# EAGLE schematic LinPsu (EAGLE 7.6.0)
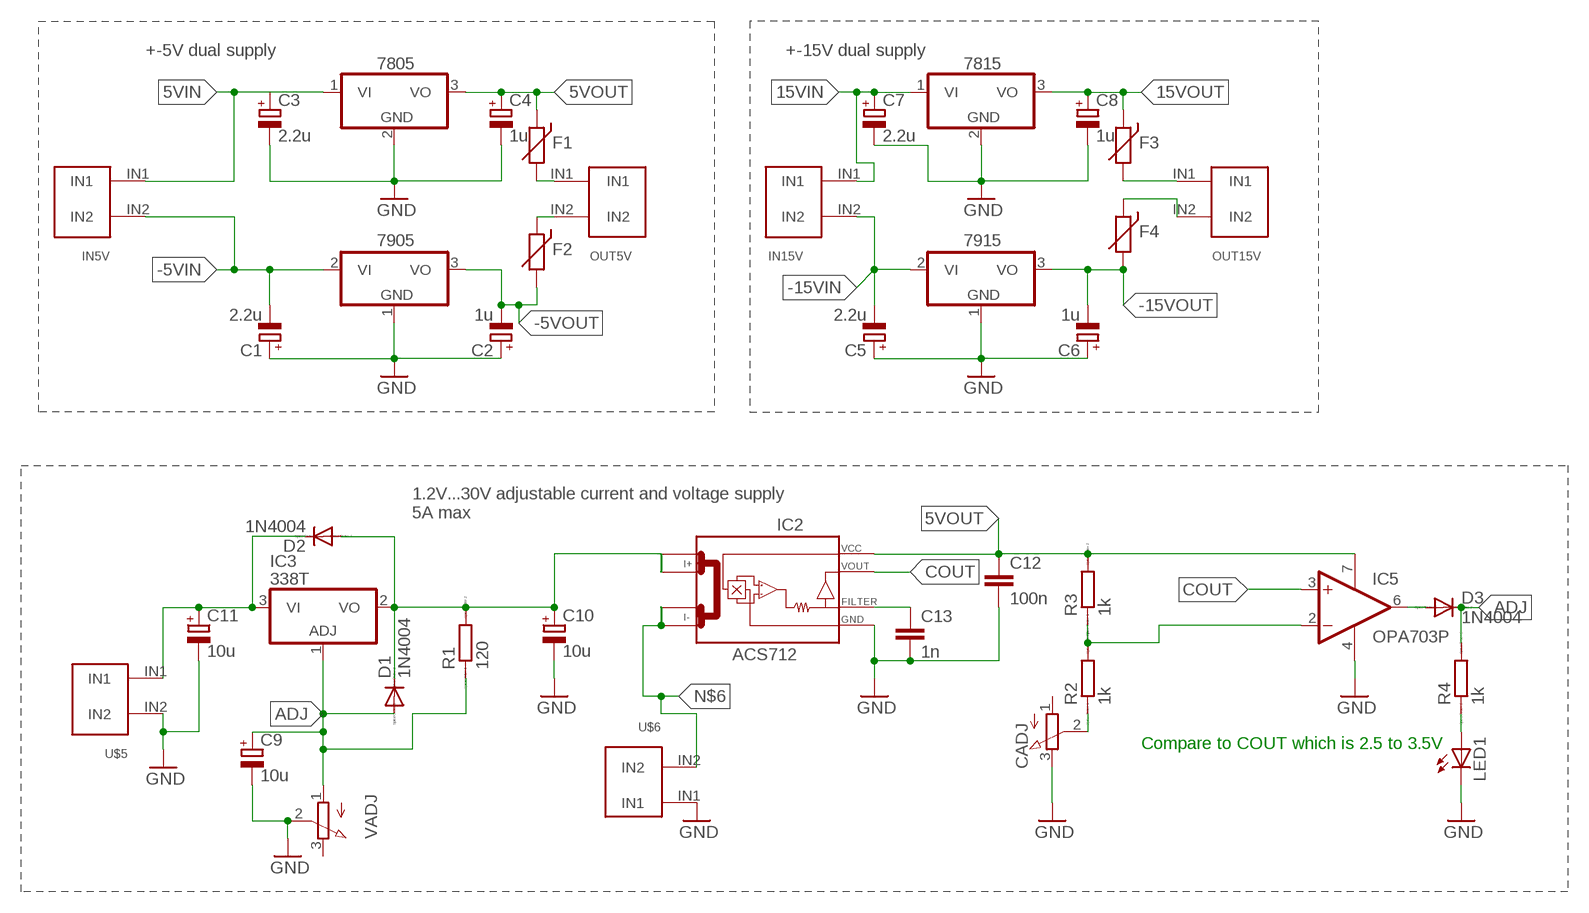
[diagram p0: schematic, sheet 1]

## Parts
7805  7805  7815T  [TO220H]
7815  7815T  [TO220H]
7905  7905T  [TO220H]
7915  7915T  [TO220H]
C1  2.2u  CPOL-EUE5-5  [E5-5]
C2  1u  CPOL-EUE5-4  [E5-4]
C3  2.2u  CPOL-EUE5-5  [E5-5]
C4  1u  CPOL-EUE5-4  [E5-4]
C5  2.2u  CPOL-EUE5-5  [E5-5]
C6  1u  CPOL-EUE5-4  [E5-4]
C7  2.2u  CPOL-EUE5-5  [E5-5]
C8  1u  CPOL-EUE5-4  [E5-4]
C9  10u  CPOL-EUE5-5  [E5-5]
C10  10u  CPOL-EUE5-5  [E5-5]
C11  10u  CPOL-EUE5-5  [E5-5]
C12  100n  C2.5/4  [C2.5-4]
C13  1n  C2.5/4  [C2.5-4]
CADJ  3RP/1610N  [3RP/1610N]
D1  1N4004  [DO41-10]
D2  1N4004  [DO41-10]
D3  1N4004  [DO41-10]
F1  THERMISTOR-5  [R-5]
F2  THERMISTOR-5  [R-5]
F3  THERMISTOR-5  [R-5]
F4  THERMISTOR-5  [R-5]
IC2  ACS712  [SO08]
IC3  338T  317T  [TO220H]
IC5  OPA703P  OPA743P  [DIL08]
IN5V  1X2_5MM  [1X2_5MM]
IN15V  1X2_5MM  [1X2_5MM]
LED1  LED3MM  [LED3MM]
OUT5V  1X2_5MM  [1X2_5MM]
OUT15V  1X2_5MM  [1X2_5MM]
R1  120  R0207/10  [0207/10]
R2  1k  R0207/10  [0207/10]
R3  1k  R0207/10  [0207/10]
R4  1k  R0207/10  [0207/10]
U$5  1X2_5MM  [1X2_5MM]
U$6  1X2_5MM  [1X2_5MM]
VADJ  3RP/1610N  [3RP/1610N]

## Nets
5VIN: 7805.1(VI) C3.+ IN5V.IN1
5VOUT: 7805.3(VO) C4.+ C12.1 F1.1 IC2.8(VCC) IC5.7(V+) R3.2
15VIN: 7815.1(VI) C7.+ IN15V.IN1
15VOUT: 7815.3(VO) C8.+ F3.1
-5VIN: 7905.2(VI) C1.- IN5V.IN2
-5VOUT: 7905.3(VO) C2.- F2.2
-15VIN: 7915.2(VI) C5.- IN15V.IN2
-15VOUT: 7915.3(VO) C6.- F4.2
ADJ: C9.+ D1.A D3.C IC3.1(ADJ) R1.1 R4.2 VADJ.1(A)
COUT: IC2.7(VOUT) IC5.3(+IN)
GND: 7805.2(GND) 7815.2(GND) 7905.1(GND) 7915.1(GND) C1.+ C2.+ C3.- C4.- C5.+ C6.+ C7.- C8.- C9.- C10.- C11.- C12.2 C13.2 CADJ.3(E) IC2.5(GND) IC5.4(V-) LED1.K(C) U$5.IN2 U$6.IN1 VADJ.2(S)
N$1: C11.+ D2.C IC3.3(VI) U$5.IN1
N$2: F1.2 OUT5V.IN1
N$3: LED1.A R4.1
N$4: D3.A IC5.6(OUT)
N$5: C13.1 IC2.6(FILTER)
N$6: IC2.3(I-_0) IC2.4(I-_1) U$6.IN2
N$7: IC5.2(-IN) R2.2 R3.1
N$8: F2.1 OUT5V.IN2
N$9: CADJ.2(S) R2.1
N$10: F3.2 OUT15V.IN1
OUT15V: F4.1 OUT15V.IN2
VOUTADJ: C10.+ D1.C D2.A IC2.1(I+_0) IC3.2(VO) R1.2
Unconnected: CADJ.1(A) IC2.2(I+_1) VADJ.3(E)

## Notes on the sheet
- +-5V dual supply | +-15V dual supply
- 1.2V...30V adjustable current and voltage supply
  5A max
- Compare to COUT which is 2.5 to 3.5V

## Library data of the parts
7805 7815 = linear:78*: Positive VOLTAGE REGULATOR Source: http://cache.national.com/ds/LM/LM78L05.pdf http://www.fairchildsemi.com/ds/LM/LM7805.pdf
7905 7915 = linear:79*: Negative VOLTAGE REGULATOR
C1-C11 = rcl:CPOL-EU: POLARIZED CAPACITOR, European symbol
C12 C13 = capacitor-wima:C: CAPACITOR naming: grid - package width
CADJ VADJ = dorupot:3RP/1610N: 16mm Potentiometer one level Source: http://www.alphapotentiometers.net/html/16mm_pot_2.html
D1-D3 = diode:1N4004: DIODE general purpose rectifier, 1 A
F1-F4 = varistor:THERMISTOR: THERMISTOR
IC2 = ACS712:ACS712
IC3 = linear:*317: Positive VOLTAGE REGULATOR
IC5 = linear:OPA743: 12V, 7MHz, CMOS, Rail-to-Rail I/O OP AMP Source: http://focus.ti.com/lit/ds/sbos201/sbos201.pdf
IN5V IN15V OUT5V OUT15V U$5 U$6 = doru_terminal_block:1X2_5MM
LED1 = led:LED: LED OSRAM: - CHIPLED LG R971, LG N971, LY N971, LG Q971, LY Q971, LO R971, LY R971 LH N974, LH R974 LS Q976, LO Q976, LY Q976 LO Q996 - Hyper CHIPLED LW Q18S LB Q993, LB Q99A, LB R99A - SideLED LS A670, LO A670, LY A670, LG A670, LP A670 LB A673, LV A673, LT A673, LW A673 LH A674 LY A675 LS A676, LA A676, LO A676, LY A676, LW A676 LS A679, LY A679, LG A679 - Hyper Micro SIDELED® LS Y876, LA Y876, LO Y876, LY Y876 LT Y87S - SmartLED LW L88C, LW L88S LB L89C, LB L89S, LG L890 LS L89K, LO L89K, LY L89K LS L896, LA L896, LO L896, LY L896 - TOPLED LS T670, LO T670, LY T670, LG T670, LP T670 LSG T670, LSP T670, LSY T670, LOP T670, LYG T670 LG T671, LOG T671, LSG T671 LB T673, LV T673, LT T673, LW T673 LH T674 LS T676, LA T676, LO T676, LY T676, LB T676, LH T676, LSB T676, LW T676 LB T67C, LV T67C, LT T67C, LS T67K, LO T67K, LY T67K, LW E67C LS E67B, LA E67B, LO E67B, LY E67B, LB E67C, LV E67C, LT E67C LW T67C LS T679, LY T679, LG T679 LS T770, LO T770, LY T770, LG T770, LP T770 LB T773, LV T773, LT T773, LW T773 LH T774 LS E675, LA E675, LY E675, LS T675 LS T776, LA T776, LO T776, LY T776, LB T776 LHGB T686 LT T68C, LB T68C - Hyper Mini TOPLED® LB M676 - Mini TOPLED Santana® LG M470 LS M47K, LO M47K, LY M47K Source: http://www.osram.convergy.de LUXEON: - LUMILED® LXK2-PW12-R00, LXK2-PW12-S00, LXK2-PW14-U00, LXK2-PW14-V00 LXK2-PM12-R00, LXK2-PM12-S00, LXK2-PM14-U00 LXK2-PE12-Q00, LXK2-PE12-R00, LXK2-PE12-S00, LXK2-PE14-T00, LXK2-PE14-U00 LXK2-PB12-K00, LXK2-PB12-L00, LXK2-PB12-M00, LXK2-PB14-N00, LXK2-PB14-P00, LXK2-PB14-Q00 LXK2-PR12-L00, LXK2-PR12-M00, LXK2-PR14-Q00, LXK2-PR14-R00 LXK2-PD12-Q00, LXK2-PD12-R00, LXK2-PD12-S00 LXK2-PH12-R00, LXK2-PH12-S00 LXK2-PL12-P00, LXK2-PL12-Q00, LXK2-PL12-R00 Source: www.luxeon.com KINGBRIGHT: KA-3528ASYC Source: www.kingbright.com
R1-R4 = eagle-ltspice:R: RESISTOR, European symbol; SPICEMODEL: NONE; SPICEPREFIX: R